# Altium schematic sheet CPLD.SchDoc
size A4; SheetNumber: 6; SheetTotal: 10
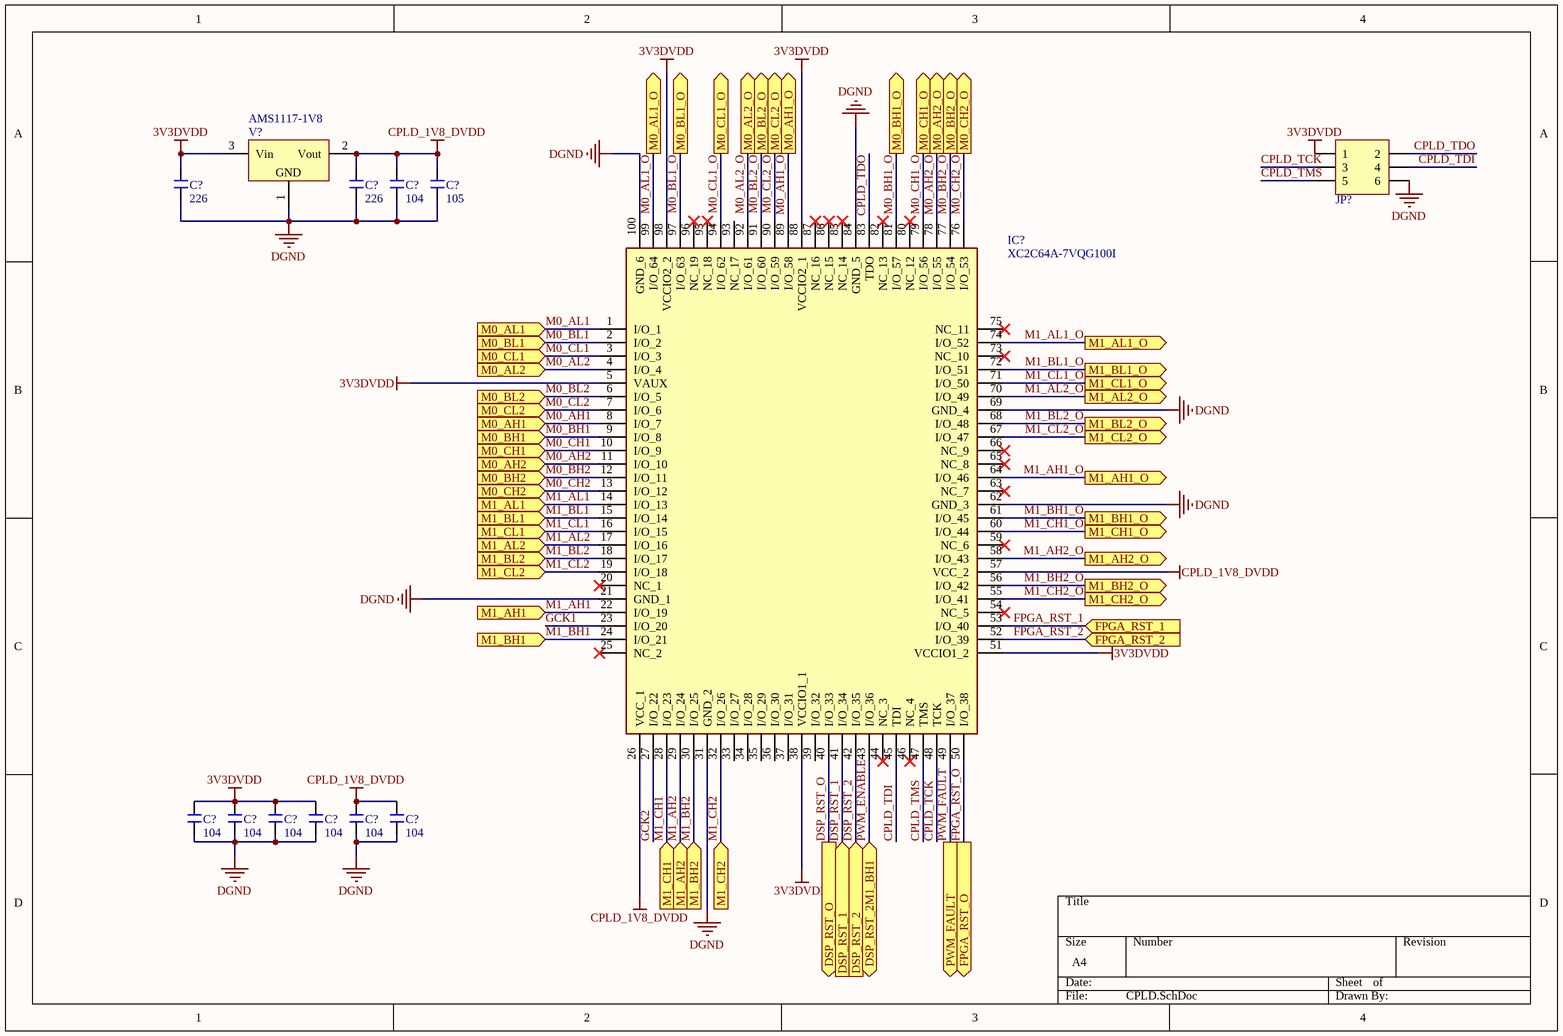
[diagram p0: CPLD.SchDoc]

## Parts
(Parts that share a designator on the sheet are numbered #1, #2 ... from top to bottom, then left to right.)
C?#1  226  [C 1206_L]
C?#2  226  [C 1206_L]
C?#3  104  [C 0603_L]
C?#4  105  [C 0603_L]
C?#5  104  [C 0603_L]
C?#6  104  [C 0603_L]
C?#7  104  [C 0603_L]
C?#8  104  [C 0603_L]
C?#9  104  [C 0603_L]
C?#10  104  [C 0603_L]
IC?  XC2C64A-7VQG100I  [QFP50P1600X1600X120-100N]
JP?  Header3X2  [IDC2.54-LI-2x3P]  (value not drawn)
V?  AMS1117-1V8  [SOT223_L]

## Ports
DSP_RST_1 (in), DSP_RST_2 (in), DSP_RST_2M1_BH1 (bidir), DSP_RST_O (out), FPGA_RST_1 (in), FPGA_RST_2 (in), FPGA_RST_O (out), M0_AH1 (in), M0_AH1_O (out), M0_AH2 (in), M0_AH2_O (out), M0_AL1 (in), M0_AL1_O (out), M0_AL2 (in), M0_AL2_O (out), M0_BH1 (in), M0_BH1_O (out), M0_BH2 (in), M0_BH2_O (out), M0_BL1 (in), M0_BL1_O (out), M0_BL2 (in), M0_BL2_O (out), M0_CH1 (in), M0_CH1_O (out), M0_CH2 (in), M0_CH2_O (out), M0_CL1 (in), M0_CL1_O (out), M0_CL2 (in), M0_CL2_O (out), M1_AH1 (in), M1_AH1_O (out), M1_AH2 (in), M1_AH2_O (out), M1_AL1 (in), M1_AL1_O (out), M1_AL2 (in), M1_AL2_O (out), M1_BH1 (in), M1_BH1_O (out), M1_BH2 (in), M1_BH2_O (out), M1_BL1 (in), M1_BL1_O (out), M1_BL2 (in), M1_BL2_O (out), M1_CH1 (in), M1_CH1_O (out), M1_CH2 (in), M1_CH2_O (out), M1_CL1 (in), M1_CL1_O (out), M1_CL2 (in), M1_CL2_O (out), PWM_FAULT (out)

## Nets
3V3DVDD: C?#1.2 C?#5.2 C?#6.2 C?#7.2 C?#8.2 IC?.5(VAUX) IC?.38(VCCIO1_1) IC?.51(VCCIO1_2) IC?.88(VCCIO2_1) IC?.98(VCCIO2_2) JP?.1 V?.3(Vin)
CPLD_1V8_DVDD: C?#2.2 C?#3.2 C?#4.2 C?#9.2 C?#10.2 IC?.26(VCC_1) IC?.57(VCC_2) V?.2(Vout)
DGND: C?#1.1 C?#2.1 C?#3.1 C?#4.1 C?#5.1 C?#6.1 C?#7.1 C?#8.1 C?#9.1 C?#10.1 IC?.21(GND_1) IC?.31(GND_2) IC?.62(GND_3) IC?.69(GND_4) IC?.84(GND_5) IC?.100(GND_6) JP?.6 V?.1(GND)
CPLD_TCK: IC?.48(TCK) JP?.3
CPLD_TDI: IC?.45(TDI) JP?.4
CPLD_TDO: IC?.83(TDO) JP?.2
CPLD_TMS: IC?.47(TMS) JP?.5
DSP_RST_1: IC?.41(I/O_34) ; port DSP_RST_1
DSP_RST_2: IC?.42(I/O_35) ; port DSP_RST_2
DSP_RST_O: IC?.40(I/O_33) ; port DSP_RST_O
FPGA_RST_1: IC?.53(I/O_40) ; port FPGA_RST_1
FPGA_RST_2: IC?.52(I/O_39) ; port FPGA_RST_2
FPGA_RST_O: IC?.50(I/O_38) ; port FPGA_RST_O
GCK1: IC?.23(I/O_20)
GCK2: IC?.27(I/O_22)
M0_AH1: IC?.8(I/O_7) ; port M0_AH1
M0_AH1_O: IC?.89(I/O_58) ; port M0_AH1_O
M0_AH2: IC?.11(I/O_10) ; port M0_AH2
M0_AH2_O: IC?.78(I/O_55) ; port M0_AH2_O
M0_AL1: IC?.1(I/O_1) ; port M0_AL1
M0_AL1_O: IC?.99(I/O_64) ; port M0_AL1_O
M0_AL2: IC?.4(I/O_4) ; port M0_AL2
M0_AL2_O: IC?.92(I/O_61) ; port M0_AL2_O
M0_BH1: IC?.9(I/O_8) ; port M0_BH1
M0_BH1_O: IC?.81(I/O_57) ; port M0_BH1_O
M0_BH2: IC?.12(I/O_11) ; port M0_BH2
M0_BH2_O: IC?.77(I/O_54) ; port M0_BH2_O
M0_BL1: IC?.2(I/O_2) ; port M0_BL1
M0_BL1_O: IC?.97(I/O_63) ; port M0_BL1_O
M0_BL2: IC?.6(I/O_5) ; port M0_BL2
M0_BL2_O: IC?.91(I/O_60) ; port M0_BL2_O
M0_CH1: IC?.10(I/O_9) ; port M0_CH1
M0_CH1_O: IC?.79(I/O_56) ; port M0_CH1_O
M0_CH2: IC?.13(I/O_12) ; port M0_CH2
M0_CH2_O: IC?.76(I/O_53) ; port M0_CH2_O
M0_CL1: IC?.3(I/O_3) ; port M0_CL1
M0_CL1_O: IC?.94(I/O_62) ; port M0_CL1_O
M0_CL2: IC?.7(I/O_6) ; port M0_CL2
M0_CL2_O: IC?.90(I/O_59) ; port M0_CL2_O
M1_AH1: IC?.22(I/O_19) ; port M1_AH1
M1_AH1_O: IC?.64(I/O_46) ; port M1_AH1_O
M1_AH2: IC?.29(I/O_24) ; port M1_AH2
M1_AH2_O: IC?.58(I/O_43) ; port M1_AH2_O
M1_AL1: IC?.14(I/O_13) ; port M1_AL1
M1_AL1_O: IC?.74(I/O_52) ; port M1_AL1_O
M1_AL2: IC?.17(I/O_16) ; port M1_AL2
M1_AL2_O: IC?.70(I/O_49) ; port M1_AL2_O
M1_BH1: IC?.24(I/O_21) ; port M1_BH1
M1_BH1_O: IC?.61(I/O_45) ; port M1_BH1_O
M1_BH2: IC?.30(I/O_25) ; port M1_BH2
M1_BH2_O: IC?.56(I/O_42) ; port M1_BH2_O
M1_BL1: IC?.15(I/O_14) ; port M1_BL1
M1_BL1_O: IC?.72(I/O_51) ; port M1_BL1_O
M1_BL2: IC?.18(I/O_17) ; port M1_BL2
M1_BL2_O: IC?.68(I/O_48) ; port M1_BL2_O
M1_CH1: IC?.28(I/O_23) ; port M1_CH1
M1_CH1_O: IC?.60(I/O_44) ; port M1_CH1_O
M1_CH2: IC?.32(I/O_26) ; port M1_CH2
M1_CH2_O: IC?.55(I/O_41) ; port M1_CH2_O
M1_CL1: IC?.16(I/O_15) ; port M1_CL1
M1_CL1_O: IC?.71(I/O_50) ; port M1_CL1_O
M1_CL2: IC?.19(I/O_18) ; port M1_CL2
M1_CL2_O: IC?.67(I/O_47) ; port M1_CL2_O
PWM_ENABLE: IC?.43(I/O_36) ; port DSP_RST_2M1_BH1
PWM_FAULT: IC?.49(I/O_37) ; port PWM_FAULT

Not connected (* = marked no-connect by the designer): IC? 20(NC_1)* 25(NC_2)* 33(I/O_27) 34(I/O_28) 35(I/O_29) 36(I/O_30) 37(I/O_31) 39(I/O_32) 44(NC_3)* 46(NC_4)* 54(NC_5)* 59(NC_6)* 63(NC_7)* 65(NC_8)* 66(NC_9)* 73(NC_10)* 75(NC_11)* 80(NC_12)* 82(NC_13)* 85(NC_14)* 86(NC_15)* 87(NC_16)* 93(NC_17) 95(NC_18)* 96(NC_19)*

## Library data of the parts
C?#1-C?#10 = C: 贴片电容; BOM名称: 无极性贴片电容
IC? = XC2C64A-7VQG100I: Integrated Circuit; Manufacturer_Name: XILINX; Datasheet Link: https://docs.xilinx.com/v/u/en-US/ds311; Height: 1.2mm; Manufacturer_Part_Number: XC2C64A-7VQG100I; Mouser Part Number: 217-XC2C64A-7VQG100I; Mouser Price/Stock: https://www.mouser.co.uk/ProductDetail/Xilinx/XC2C64A-7VQG100I?qs=rrS6PyfT74c4zVdxhv%2F4jw%3D%3D
JP? = Header 3X2: 3*2P接插件; 版权归属: 封装库来自淘宝 ID：黄晶宝石; BOM名称: 3*2P接插件; 学习资源: https://shop463601444.taobao.com
V? = AMS1117: 三端稳压芯片; BOM名称: 稳压芯片